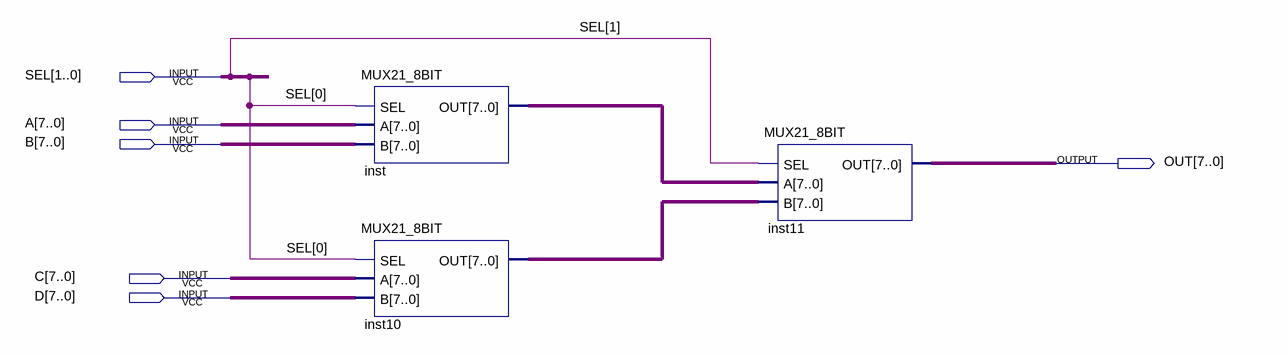
[diagram p0: schematic sheet]
// Quartus schematic MUX41_8BIT.bdf as structural Verilog: 3 symbols, 6 pins
module MUX41_8BIT (
  input  [1:0] SEL,
  input  [7:0] A,
  input  [7:0] B,
  input  [7:0] C,
  input  [7:0] D,
  output [7:0] OUT
);

  wire [7:0] inst10_out, inst_out;

  MUX21_8BIT inst (.SEL(SEL[0]), .A(A), .B(B), .OUT(inst_out));
  MUX21_8BIT inst10 (.SEL(SEL[0]), .A(C), .B(D), .OUT(inst10_out));
  MUX21_8BIT inst11 (.SEL(SEL[1]), .A(inst_out), .B(inst10_out), .OUT(OUT));
endmodule
